# Altium schematic sheet delyiannis_filter.SchDoc
size A4; SheetNumber: 3; SheetTotal: 5
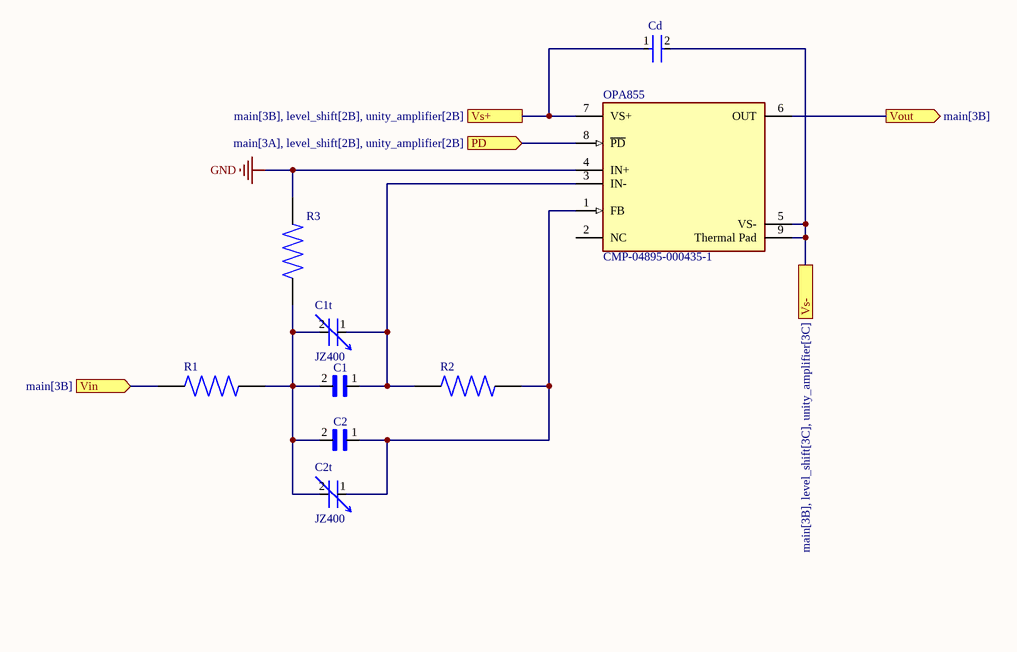
[diagram p0: delyiannis_filter.SchDoc]

## Parts
C1  CC0402BRNPO9BN8R2  [CAPC1005X55N]  (value not drawn)
C1t  JZ400  [FP-JZ400-MFG]
C2  CC0402BRNPO9BN8R2  [CAPC1005X55N]  (value not drawn)
C2t  JZ400  [FP-JZ400-MFG]
Cd  C0402C104K4RACTU  [FP-C0402-BB-MFG]  (value not drawn)
OPA855  CMP-04895-000435-1  [FP-DSG0008A-MFG]
R1  RN73H1ETTP26R4F50  [RESC1005X40N]  (value not drawn)
R2  RC0603FR-0753R6L  [RESC1608X55N]  (value not drawn)
R3  RMCF0603FT634R  [RESC1508X55N]  (value not drawn)

## Ports
PD (in, see main[3A], level_shift[2B], unity_amplifier[2B]), Vin (in, see main[3B]), Vout (out, see main[3B]), Vs+ (see main[3B], level_shift[2B], unity_amplifier[2B]), Vs- (see main[3B], level_shift[3C], unity_amplifier[3C])

## Nets
GND: OPA855.4(IN+) R3.1
PD: OPA855.8(~{PD}) ; port PD
Vin: R1.1 ; port Vin
Vout: OPA855.6(OUT) ; port Vout
Vs+: Cd.1 OPA855.7(VS+) ; port Vs+
Vs-: Cd.2 OPA855.5(VS-) OPA855.9(Thermal_Pad) ; port Vs-
NetC1_1: C1.1 C1t.1(HOT) OPA855.3(IN-) R2.1
NetC1_2: C1.2 C1t.2(COLD) C2.2 C2t.2(COLD) R1.2 R3.2
NetC2_1: C2.1 C2t.1(HOT) OPA855.1(FB) R2.2

Not connected (* = marked no-connect by the designer): OPA855 2(NC)

## Library data of the parts
C1 C2 = CC0402BRNPO9BN8R2: KC 8,2pF 0402 0,10pF 50V NP0; Package: None; Price: None; Value: *; MP: CC0402BRNPO9BN8R2; Availability: Unavailable
C1t C2t = CMP-249250-000001-1: CAP TRIMMER 8-40PF 125V SMD; Dielectric Material: Ceramic; Tolerance: 100%; Capacitance: 0.00000000004F; Test Frequency: 1MHz; Q Factor: 1500; Voltage Rating: 125V; Resistor Type: Ceramic; Height: 1.5mm; Features: General Purpose; Min Operating Temperature: -40°C; Max Operating Temperature: 85°C; RoHS Compliant: Yes; Length: 4.5mm; Width: 3.2mm; Packaging: Cut Tape; Mount: Surface Mount; Series: JZ; Termination: SMD/SMT
Cd = CMP-2008-02108-2: CAP CER 0.1UF 16V X7R 0402; Manufacturer: Kemet; Value: 0.10 μF; Tolerance: 0.1; Temperature Coefficient: 15%; Voltage Rating: 16 V; Package: C0402-BB; Automotive: No; Ipc Land Pattern Name: CAPC10050X50; Device Class L3: Ceramic Capacitors; Capacitance: 0.10 μF; Octopart: https://octopart.com/c0402c104k4ractu-kemet-94158; Temperature Characteristic: X7R; Mouser Description: Cap Ceramic 0.1uF 16V X7R 10% SMD 0402 125?C Paper T/R - Tape and Reel (Alt: C0402C104K4RAC TU); ComponentLink2Description: Datasheet; Temperature Range Low: -55°C; RoHS: TRUE; Device Class L1: Passive Components; Manufacturer Part Number: C0402C104K4RACTU; Material: Ceramic; Temperature Range High: +125°C; Device Class L2: Capacitors; ComponentLink2URL: https://content.kemet.com/datasheets/KEM_C1002_X7R_SMD.pdf; Category: Cap; Height: 0.55mm; Temperature: -55°C to +125°C; Lead Free: Yes; Digikey Description: CAP CER 0.1UF 16V X7R 0402
OPA855 = CMP-007-000000-2: IC OPAMP GP 1 CIRCUIT 8WSON; Source: Components - 05.10.22 - 21.23.SchLib; RoHS Compliant: Yes; Design Item ID: CMP-04895-000435-1
R2 = RC0603FR-0753R6L: Res Thick Film 0603 53.6 Ohm 1% 0.1W(1/10W) ?100ppm/?C Molded SMD Paper T/R; Package: None; Price: None; Value: *; MP: RC0603FR-0753R6L; Availability: Unavailable
R1 = RN73H1ETTP26R4F50: Package: None; Price: None; Value: *; MP: RN73H1ETTP26R4F50; Availability: Unavailable
R3 = RMCF0603FT634R: Package: None; Price: None; Value: *; MP: RMCF0603FT634R; Availability: Unavailable